# Altium schematic sheet HVSystem.SchDoc
size A4
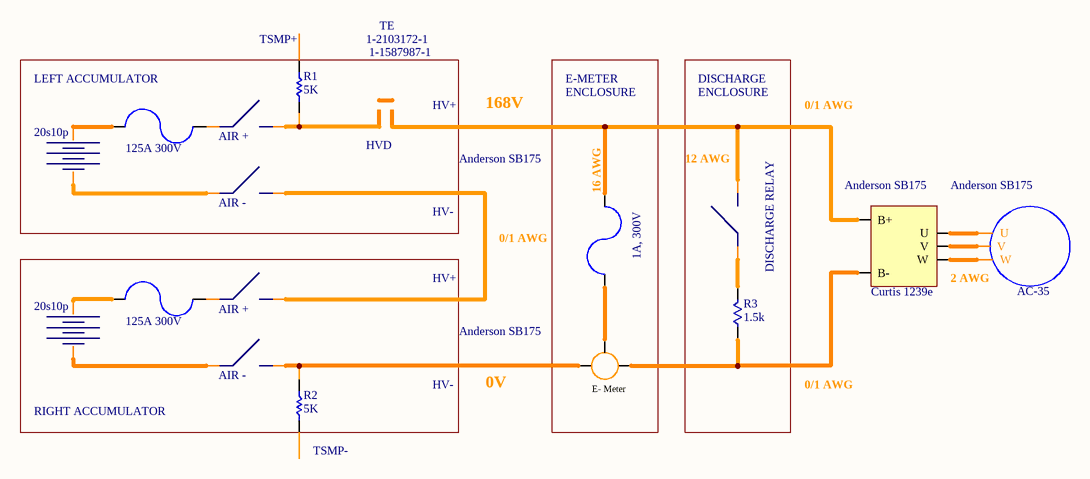
[diagram p0: HVSystem.SchDoc]

## Parts
(Parts that share a designator on the sheet are numbered #1, #2 ... from top to bottom, then left to right.)
125A_300V  125A 300V
*  HVD
?#1  1A, 300V
?#2  125A 300V
AIR+  AIR +
AIR+1  AIR -
AIR+2  DISCHARGE RELAY
AIR-  AIR -
AIR-1  AIR +
battery  20s10p
battery1  20s10p
inverter  Curtis 1239e
meter  E-meter  (value not drawn)
motor  AC-35
R1  5K
R2  5K
R3  1.5k

## Nets
Net125A_300V_1: 125A_300V.1 battery.1
Net125A_300V_2: 125A_300V.2 AIR+.1
Net?#1_1: ?#1.1 meter.?3
Net?#1_2: ?#1.2 AIR+2.2 inverter.2(B+)
Net?#2_1: ?#2.1 battery1.1
Net?#2_2: ?#2.2 AIR-1.1
NetAIR+1_1: AIR+1.1 battery.2
NetAIR+1_2: AIR+1.2 AIR-1.2
NetAIR+2_1: AIR+2.1 R3.2
NetAIR+_2: AIR+.2 R1.1
NetAIR-_1: AIR-.1 battery1.2
NetAIR-_2: AIR-.2 meter.?1 R2.2
Netinverter_1: inverter.1(B-) meter.?2 R3.1
Netinverter_3: inverter.3(U) motor.3(U)
Netinverter_4: inverter.4(V) motor.4(V)
Netinverter_5: inverter.5(W) motor.5(W)

Not connected (* = marked no-connect by the designer): R1 2; R2 1

## Notes on the sheet
- (near R1) TSMP+
- 1-2103172-1
- (near *) 1-1587987-1
- TE
- LEFT ACCUMULATOR
- (near *) HV+
- 168V
- E-METER
- ENCLOSURE
- DISCHARGE
- 0/1 AWG
- Anderson SB175
- (near ?#1) 16 AWG
- (near AIR+2) 12 AWG
- (near inverter) Anderson SB175
- HV-
- HV+
- (near meter) Anderson SB175
- 2 AWG
- RIGHT ACCUMULATOR
- 0V
- (near R2) TSMP-
- (in symbol E-meter) E- Meter /

## Library data of the parts
125A_300V ?#1 ?#2 = FUSE
AIR+ AIR+1 AIR+2 AIR- AIR-1 = AIR
battery battery1 = Battery
inverter = Inverter
motor = Motor
R1 R2 = RES
R3 = Resistor